# EAGLE board iSensorGetway-v0.1 (EAGLE 6.6.0), part 1 of 2
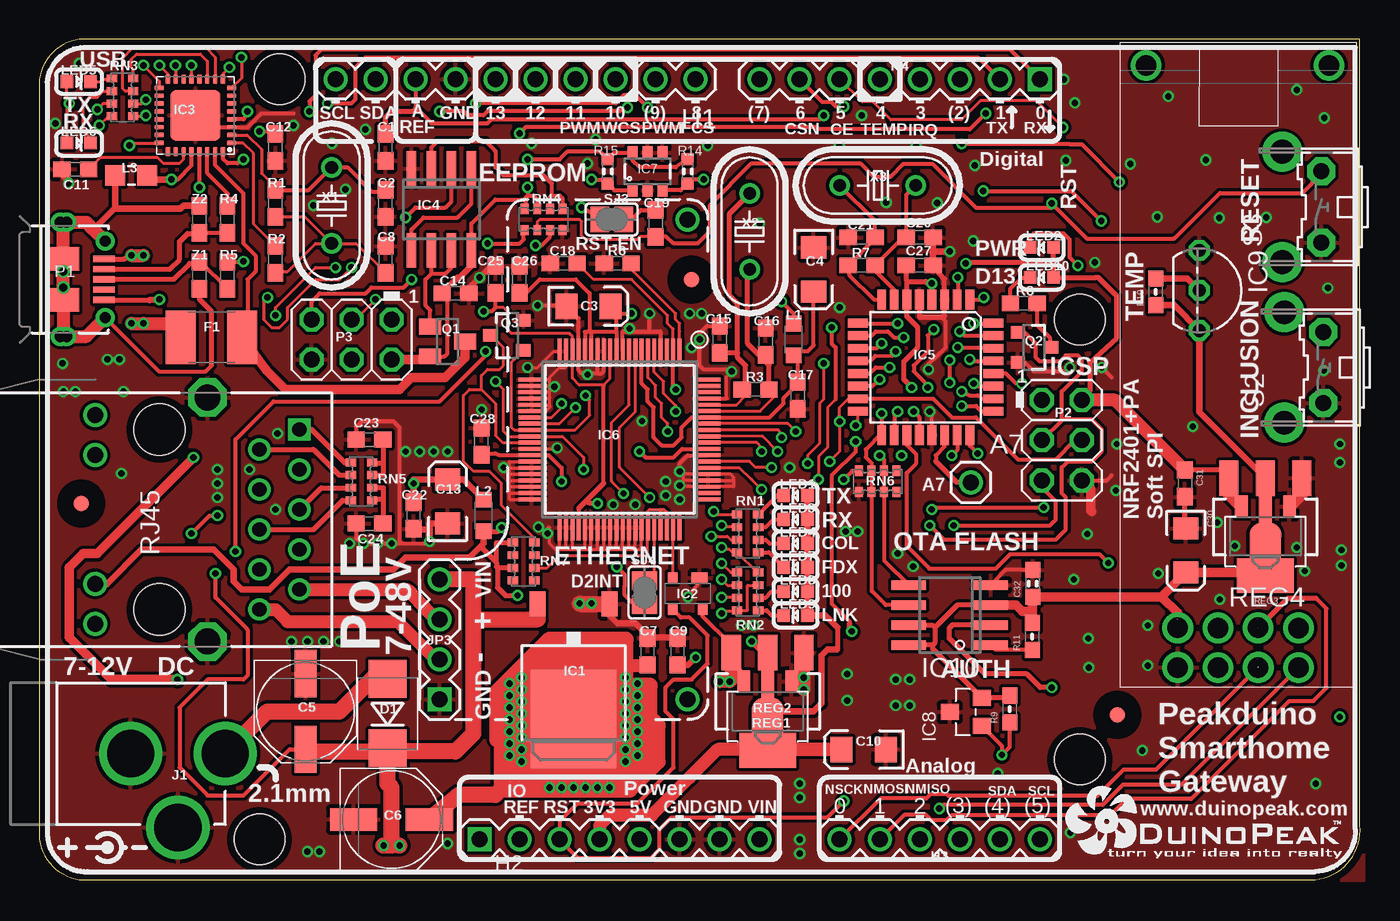
[diagram p1: board, top side]
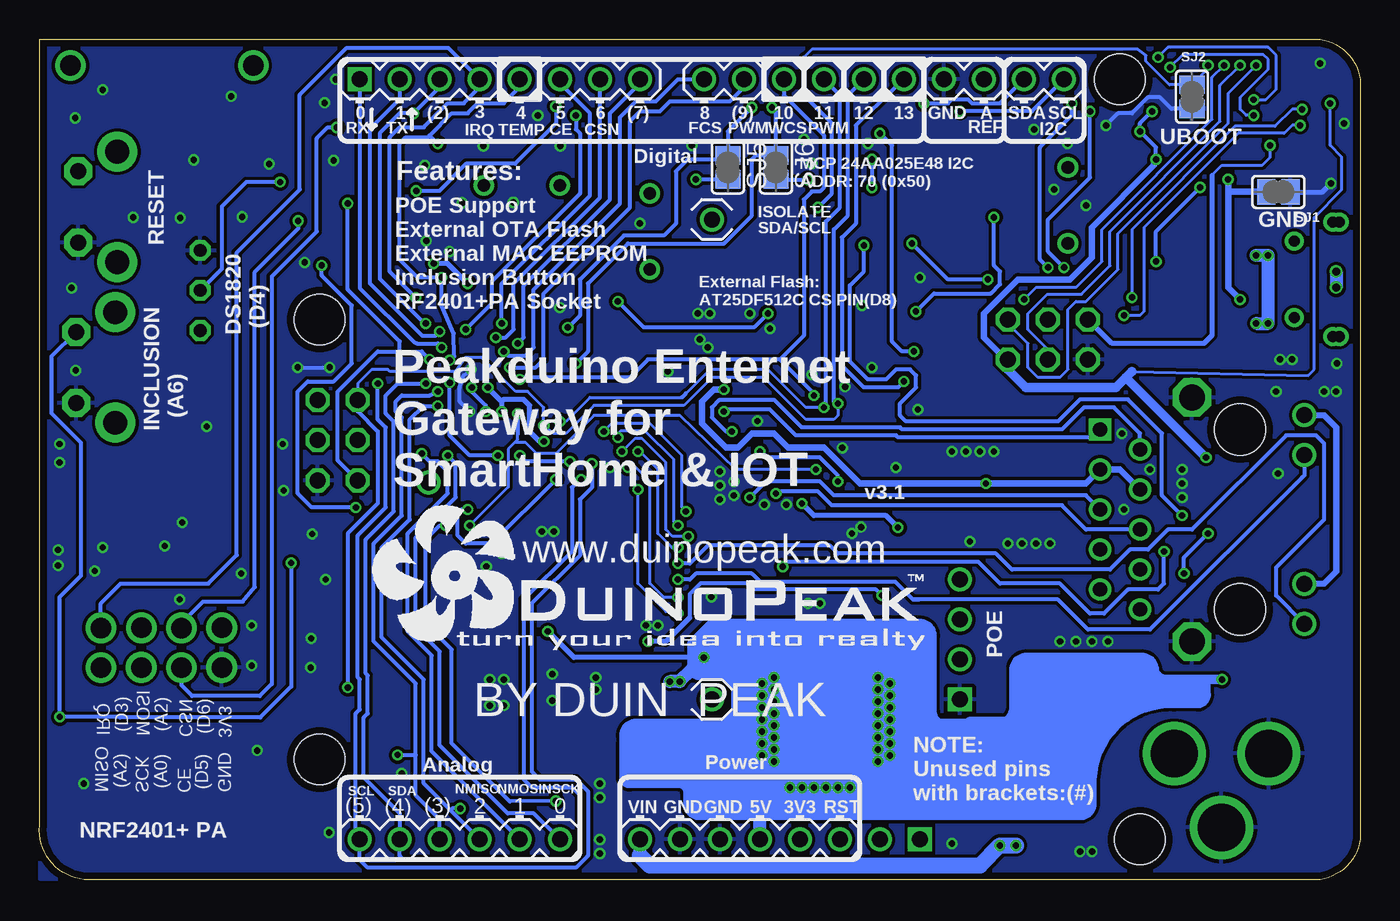
[diagram p2: board, bottom side, seen from below]

Size 83.83 x 53.34 mm. Coordinates in mm from the lower left corner, seen from the top.
Outline: 0,2.54 arc74 2.54,0 80.99,0 arc90 83.82,3.43 83.82,53.34 2.54,53.34 arc74 0,50.8 0,2.54
Copper layers (1*16): Top 0.035mm / dielectric 1.5mm / Bottom 0.035mm
Design rules "default": minimum track width 8mil, minimum drill 15mil, track to track 8mil, track to pad 8mil, pad to pad 8mil, via to via 8mil, smd to smd 8mil, copper to edge 18mil, drill to drill 8mil, minimum pad ring 10mil, minimum via ring 6mil, stop-mask expansion 4mil, vias tented up to drill 25mil, thermal gap 10mil
Net classes: 2 gnd: width 0.203 mm, drill 0.381 mm, clearance 0.178 mm
Holes 3.2 mm at 66.04,35.56 66.04,7.62 13.97,2.54 15.24,50.8
tRestrict: area 40.4,37.1 to 42.4,39.1; area 67.4,9.4 to 69.4,11.5; area 1.7,22.9 to 3.7,24.9

## Footprints (pad centres in the part's own frame; a part is rotated, then mirrored left to right if it is on the bottom)
1X01 = drill 1.016: 1 0,0
0603 = smd 1.1 x 1: 1 -0.85,0; 2 0.85,0
EIA3216 = smd 1.4 x 1.6: A 1.4,0; C -1.4,0
PANASONIC_D = smd 3 x 1.4: + 2.4,0; - -2.4,0
0603-CAP = smd 1.016 x 0.965: 1 -0.85,0; 2 0.85,0
SMB-DIODE = smd 2.4 x 2.4: A 2.2,0; C -2.2,0
L1812 = smd 1.9 x 3.4: 1 -1.95,0; 2 1.95,0
FIDUCIAL-1X2.5 = smd 1 x 1: 1 0,0
1X10 = drill 1.016: 1 0,0; 2 2.54,0; 3 5.08,0; 4 7.62,0; 5 10.16,0; 6 12.7,0; 7 15.24,0; 8 17.78,0; 9 20.32,0; 10 22.86,0
1X08 = drill 1.016 square: 1 0,0 | drill 1.016: 2 2.54,0; 3 5.08,0; 4 7.62,0; 5 10.16,0; 6 12.7,0; 7 15.24,0; 8 17.78,0
1X06 = drill 1.016: 1 0,0; 2 2.54,0; 3 5.08,0; 4 7.62,0; 5 10.16,0; 6 12.7,0
DPACK = smd 1 x 1.6: 1 -2.28,-4.8; 3 2.28,-4.8 | smd 5.4 x 6.2: 2 0,2.5
SOT143-R = smd 1 x 0.7: 1 -0.75,-1 | smd 0.6 x 0.7: 2 0.95,-1; 3 0.95,1; 4 -0.95,1
ATMEL_QFN32 = smd 0.6 x 0.3: 1 -2.3,1.75; 2 -2.3,1.25; 3 -2.3,0.75; 4 -2.3,0.25; 5 -2.3,-0.25; 6 -2.3,-0.75; 7 -2.3,-1.25; 8 -2.3,-1.75; 17 2.3,-1.75; 18 2.3,-1.25; 19 2.3,-0.75; 20 2.3,-0.25; 21 2.3,0.25; 22 2.3,0.75; 23 2.3,1.25; 24 2.3,1.75 | smd 0.3 x 0.6: 9 -1.75,-2.3; 10 -1.25,-2.3; 11 -0.75,-2.3; 12 -0.25,-2.3; 13 0.25,-2.3; 14 0.75,-2.3; 15 1.25,-2.3; 16 1.75,-2.3; 25 1.75,2.3; 26 1.25,2.3; 27 0.75,2.3; 28 0.25,2.3; 29 -0.25,2.3; 30 -0.75,2.3; 31 -1.25,2.3; 32 -1.75,2.3 | smd 3.2 x 3.2: EXP 0,0
SO08 = smd 0.6 x 2.2: 1 -1.905,-2.6; 2 -0.635,-2.6; 3 0.635,-2.6; 4 1.905,-2.6; 5 1.905,2.6; 6 0.635,2.6; 7 -0.635,2.6; 8 -1.905,2.6
TQFP32-08 = smd 1.27 x 0.559: 1 -4.293,2.8; 2 -4.293,2; 3 -4.293,1.2; 4 -4.293,0.4; 5 -4.293,-0.4; 6 -4.293,-1.2; 7 -4.293,-2; 8 -4.293,-2.8; 17 4.293,-2.8; 18 4.293,-2; 19 4.293,-1.2; 20 4.293,-0.4; 21 4.293,0.4; 22 4.293,1.2; 23 4.293,2; 24 4.293,2.8 | smd 0.559 x 1.27: 9 -2.8,-4.293; 10 -2,-4.293; 11 -1.2,-4.293; 12 -0.4,-4.293; 13 0.4,-4.293; 14 1.2,-4.293; 15 2,-4.293; 16 2.8,-4.293; 25 2.8,4.293; 26 2,4.293; 27 1.2,4.293; 28 0.4,4.293; 29 -0.4,4.293; 30 -1.2,4.293; 31 -2,4.293; 32 -2.8,4.293
SQFP80 = smd 1.6 x 0.25: 1 -5.6,3.8; 2 -5.6,3.4; 3 -5.6,3; 4 -5.6,2.6; 5 -5.6,2.2; 6 -5.6,1.8; 7 -5.6,1.4; 8 -5.6,1; 9 -5.6,0.6; 10 -5.6,0.2; 11 -5.6,-0.2; 12 -5.6,-0.6; 13 -5.6,-1; 14 -5.6,-1.4; 15 -5.6,-1.8; 16 -5.6,-2.2; 17 -5.6,-2.6; 18 -5.6,-3; 19 -5.6,-3.4; 20 -5.6,-3.8; 41 5.6,-3.8; 42 5.6,-3.4; 43 5.6,-3; 44 5.6,-2.6; 45 5.6,-2.2; 46 5.6,-1.8; 47 5.6,-1.4; 48 5.6,-1; 49 5.6,-0.6; 50 5.6,-0.2; 51 5.6,0.2; 52 5.6,0.6; 53 5.6,1; 54 5.6,1.4; 55 5.6,1.8; 56 5.6,2.2; 57 5.6,2.6; 58 5.6,3; 59 5.6,3.4; 60 5.6,3.8 | smd 0.25 x 1.6: 21 -3.8,-5.6; 22 -3.4,-5.6; 23 -3,-5.6; 24 -2.6,-5.6; 25 -2.2,-5.6; 26 -1.8,-5.6; 27 -1.4,-5.6; 28 -1,-5.6; 29 -0.6,-5.6; 30 -0.2,-5.6; 31 0.2,-5.6; 32 0.6,-5.6; 33 1,-5.6; 34 1.4,-5.6; 35 1.8,-5.6; 36 2.2,-5.6; 37 2.6,-5.6; 38 3,-5.6; 39 3.4,-5.6; 40 3.8,-5.6; 61 3.8,5.6; 62 3.4,5.6; 63 3,5.6; 64 2.6,5.6; 65 2.2,5.6; 66 1.8,5.6; 67 1.4,5.6; 68 1,5.6; 69 0.6,5.6; 70 0.2,5.6; 71 -0.2,5.6; 72 -0.6,5.6; 73 -1,5.6; 74 -1.4,5.6; 75 -1.8,5.6; 76 -2.2,5.6; 77 -2.6,5.6; 78 -3,5.6; 79 -3.4,5.6; 80 -3.8,5.6
SOT23-6 = smd 0.65 x 0.8: 1 -0.95,-1.2; 2 0,-1.2; 3 0.95,-1.2; 4 0.95,1.2; 5 0,1.2; 6 -0.95,1.2
SOT23 = smd 1.016 x 1.143: 1 -0.889,-1.016; 2 0.889,-1.016; 3 0,1.016
TO92- = drill 0.813 octagon: 1 -2.54,0; 2 0,0; 3 2.54,0
SO-08 = smd 0.6 x 2.2: 1 -1.905,-2.6; 2 -0.635,-2.6; 3 0.635,-2.6; 4 1.905,-2.6; 5 1.905,2.6; 6 0.635,2.6; 7 -0.635,2.6; 8 -1.905,2.6
POWER_JACK_PTH = drill 2.997: GND 0,7.7; GNDBREAK 4.7,10.7; PWR 0,13.7
FT-POE-MODULE-NOLABEL = drill 1.016 square: 1 0,0 | drill 1.016: 2 2.54,0; 3 5.08,0; 4 7.62,0; MNT1 0,-15.748; MNT2 30.48,-15.748
L2012C = smd 1 x 1: 1 -1,0; 2 1,0
0805-LARGE = smd 1.27 x 1.27: 1 -1.016,0; 2 1.016,0
LED-0603 = smd 0.8 x 0.8: A 0,-0.75; C 0,0.75
USB-MICROB-MB05PMXX = smd 0.4 x 1.35: D+ 0,2.575; D- -0.65,2.575; GND 1.3,2.575; ID 0.65,2.575; VBUS -1.3,2.575 | smd 1.5 x 2: FIX1 -1.3,0; FIX2 1.3,0 | drill 0.7: PIN1 -2.425,2.65; PIN2 2.425,2.65; SLOT1 -3.625,-0.2; SLOT2 3.625,-0.2; TAB1 -3.625,0.2; TAB2 3.625,0.2
2X03 = drill 1.016 octagon: 1 -2.54,-1.27; 2 -2.54,1.27; 3 0,-1.27; 4 0,1.27; 5 2.54,-1.27; 6 2.54,1.27
SOT23' = smd 1 x 1.4: 1 -0.95,-1.1; 2 0.95,-1.1; 3 0,1.1
SOT23-3 = smd 0.8 x 0.9: 1 -0.95,-1; 2 0.95,-1; 3 0,1.1
0603-RES = smd 1.016 x 0.965: 1 -0.85,0; 2 0.85,0
0603' = smd 0.762 x 0.762: 1 -0.762,0; 2 0.762,0
SOT89 = smd 0.8 x 1.4: 1 -1.524,-1.905; 3 1.524,-1.905 | smd 0.8 x 1.9: 2 0,-1.651 | smd 2.032 x 3.65: 4 0,0.94
SOT223 = smd 1.219 x 2.235: 1 -2.311,-3.099; 2 0,-3.099; 3 2.311,-3.099 | smd 3.6 x 2.2: 4 0,3.099
CAY16 = smd 0.5 x 0.65: 1 -1.2,-0.675; 2 -0.4,-0.675; 3 0.4,-0.675; 4 1.2,-0.675; 5 1.2,0.675; 6 0.4,0.675; 7 -0.4,0.675; 8 -1.2,0.675
B3F-31XX = drill 1.016 pad 1.778 octagon: 1 -2.261,-1.245; 2 2.261,-1.245 | drill 1.499 pad 2.54: 3 -3.505,1.245; 4 3.505,1.245
SJ = smd 1.168 x 1.6: 1 -0.762,0; 2 0.762,0
SJC = smd 1.168 x 1.6: 1 -0.762,0; 2 0.762,0
HY931147C = drill 1.63 octagon: GND1 3.05,7.745; GND2 3.05,-7.745 | drill 0.9 square: P$1 8.89,5.715 | drill 0.9: P$2 6.35,4.445; P$3 8.89,3.175; P$4 6.35,1.905; P$5 8.89,0.635; P$6 6.35,-0.635; P$7 8.89,-1.905; P$8 6.35,-3.175; P$9 8.89,-4.445; P$10 6.35,-5.715 | drill 1.016: P$11 -4.08,6.625; P$12 -4.08,4.085; P$13 -4.08,-4.085; P$14 -4.08,-6.625 | hole 3.25: 0,5.715; 0,-5.715
NRF2401_PA_OUTLINE = drill 1.3: 3V3 3.677,3.785; CE 6.236,1.264; CSN 6.229,3.778; GND 3.683,1.27; GND1 1.676,39.491; GND2 13.278,39.484; IRQ 11.347,3.778; MISO 11.354,1.264; MOSI 8.782,3.785; SCK 8.788,1.27
HC49U-V = drill 0.813: 1 -2.413,0; 2 2.413,0

## Placement (x,y rotation side)
A7  M01PTH  [1X01]  59.12,25.21 0 top
C1  100nF 0603  [0603]  21.97,46.48 270 top
C2  22pF 0603  [0603]  21.97,42.93 90 top
C3  10uF 6.3V A TANT  [EIA3216]  34.85,36.4 0 top
C4  10uF 6.3V A TANT  [EIA3216]  49.15,38.73 270 top
C5  47uF 25V  [PANASONIC_D]  16.89,10.67 270 top
C6  47uF 25V  [PANASONIC_D]  22.35,3.81 0 top
C7  100nF 0603  [0603]  38.61,14.48 90 top
C8  22pF 0603  [0603]  21.97,39.37 270 top
C9  1uF 0603  [0603]  40.51,14.48 90 top
C10  10uF 6.3V A TANT  [EIA3216]  52.32,8.26 180 top
C11  1uF 0603  [0603]  2.29,45.09 180 top
C12  100nF 0603  [0603]  14.99,46.48 270 top
C13  10uF 6.3V A TANT  [EIA3216]  25.91,24 90 top
C14  100nF 0603  [0603]  26.42,37.21 0 top
C15  13pF  [0603]  43.18,34.29 90 top
C16  13pF  [0603]  46.1,34.16 90 top
C17  100nF  [0603]  48.13,30.73 270 top
C18  10nF  [0603]  33.27,39.12 180 top
C19  100nF 0603  [0603]  39.12,41.66 270 top
C20  22pF 0603  [0603]  55.88,40.77 180 top
C21  22pF 0603  [0603]  52.2,40.77 0 top
C22  100nF  [0603]  23.75,23.11 270 top
C23  100nF  [0603]  20.95,27.94 180 top
C24  100nF  [0603]  20.95,22.61 180 top
C25  100nF  [0603]  28.96,38.1 90 top
C26  100nF  [0603]  30.48,38.1 90 top
C27  100nF 0603  [0603]  55.88,38.99 0 top
C28  100nF  [0603]  28.07,27.81 90 top
C30  10uF 6.3V A TANT  [EIA3216]  72.77,20.89 270 top
C31  1uF 0603  [0603]  72.71,25.15 270 top
C32  0.1u  [0603-CAP]  63.06,18.8 90 top
D1  1N4004 SMB  [SMB-DIODE]  22.1,10.54 90 top
F1  500mA PTC 1812  [L1812]  10.92,34.42 0 top
FID1  FIDUCIAL1X2.5  [FIDUCIAL-1X2.5]  41.4,38.1 0 top
FID2  FIDUCIAL1X2.5  [FIDUCIAL-1X2.5]  68.42,10.45 0 top
FID3  FIDUCIAL1X2.5  [FIDUCIAL-1X2.5]  2.67,23.88 0 top
H1  Digital_8_13  [1X10]  41.66,50.8 180 top
H2  Power  [1X08]  27.94,2.54 0 top
H3  Analog  [1X06]  50.8,2.54 0 top
H4  Digital_0_7  [1X08]  63.5,50.8 180 top
IC1  MC33269DT-5.0  [DPACK]  33.91,12.7 180 top
IC2  APX811-44UG-7  [SOT143-R]  41.15,18.16 180 top
IC3  ATMEGA16U2-MU  [ATMEL_QFN32]  9.91,48.51 180 top
IC4  LM358D  [SO08]  25.53,42.55 180 top
IC5  ATMEGA328P TQFP32  [TQFP32-08]  56.26,32.53 270 top
IC6  W5100SQFP80  [SQFP80]  36.83,27.94 270 top
IC7  24AA025E48  [SOT23-6]  38.61,44.96 0 top
IC8  ATSHA204A  [SOT23]  58.8,10.64 90 top
IC9  DS1820  [TO92-]  73.63,37.4 270 top
IC10  AT25DF512C-SSHN-B  [SO-08]  57.78,16.8 90 top
J1  DC_2_1MM  [POWER_JACK_PTH]  -1.91,8 270 top
JP3  FT-POE-MODULE3  [FT-POE-MODULE-NOLABEL]  25.4,11.43 90 top
L1  1uH 250mA 0805  [L2012C]  47.88,34.29 270 top
L2  1uH 250mA 0805  [L2012C]  28.19,23.11 90 top
L3  0805 INDUCTOR  [0805-LARGE]  5.84,44.7 0 top
LED1  YELLOW  [LED-0603]  48.01,24.38 90 top
LED2  PWR/BLUE  [LED-0603]  63.63,40.13 90 top
LED3  YELLOW  [LED-0603]  48.01,22.86 90 top
LED4  RED  [LED-0603]  48.01,21.34 90 top
LED5  TX/YEL  [LED-0603]  2.5,50.65 270 top
LED6  RX/GRN  [LED-0603]  2.5,46.76 270 top
LED7  GREEN  [LED-0603]  48.01,19.81 90 top
LED8  GREEN  [LED-0603]  48.01,18.29 90 top
LED9  YELLOW  [LED-0603]  48.01,16.76 90 top
LED10  D13/RED  [LED-0603]  63.63,38.23 90 top
P1  USB-6PSMT  [USB-MICROB-MB05PMXX]  1.52,38.1 270 top
P2  ICSP:MAIN  [2X03]  64.91,27.89 270 top
P3  ICSP:USB  [2X03]  19.81,34.29 180 top
Q1  FDN340P  [SOT23']  25.91,34.16 270 top
Q2  2N7002  [SOT23-3]  63.12,33.78 270 top
Q3  2N7002  [SOT23-3]  29.72,34.54 90 top
R1  1M 0603  [0603]  14.99,42.93 90 top
R2  27R 0603  [0603]  14.99,39.37 270 top
R3  1M  [0603]  45.47,31.11 0 top
R4  22R 0603  [0603]  11.94,41.91 270 top
R5  22R 0603  [0603]  11.94,38.35 270 top
R6  12K3 1%  [0603]  36.7,39.12 0 top
R7  1M 0603  [0603]  52.2,38.99 0 top
R8  1K 0603  [0603]  62.48,36.58 180 top
R9  56k  [0603-RES]  61.59,10.83 90 top
R10  10k  [0603-RES]  70.87,37.31 90 top
R11  [0603-RES]  63.02,15.43 90 top
R14  4K7  [0603']  41.15,44.96 270 top
R15  4K7  [0603']  36.07,44.96 270 top
REG1  LD1117-SOT89  [SOT89]  46.23,10.67 180 top
REG2  LD1117-SOT223  [SOT223]  46.23,11.3 180 top
REG3  LD1117-SOT223  [SOT223]  77.82,22.38 180 top
REG4  LD1117-SOT89  [SOT89]  77.82,21.78 180 top
RN1  1K  [CAY16]  44.96,21.97 270 top
RN2  1K  [CAY16]  44.96,18.29 270 top
RN3  1K  [CAY16]  5.28,49.66 270 top
RN4  10K  [CAY16]  32,41.91 0 top
RN5  49R9 1%  [CAY16]  20.45,25.27 270 top
RN6  1K  [CAY16]  53.21,25.27 0 top
RN7  1K  [CAY16]  30.73,20.19 90 top
S2  [B3F-31XX]  80.26,32.51 90 top
S3  [B3F-31XX]  80.14,42.7 90 top
SJ1  GROUND  [SJ]  5.19,43.66 0 bottom
SJ2  UBOOT  [SJ]  10.67,49.7 90 bottom
SJ3  RESET-EN  [SJ]  36.32,41.91 0 top
SJ4  D2_INT  [SJ]  38.42,18.22 90 top
SJ5  [SJC]  40.13,45.21 270 bottom
SJ6  [SJC]  37.08,45.21 270 bottom
U1  HY931147C-RJ45  [HY931147C]  7.62,22.86 0 top
U$8  [DUINOPEAK-LOGO-1.2]  62.8,14.57 0 bottom
U$17  NRF2401  [NRF2401_PA_OUTLINE]  68.58,12.19 0 top
U$20  [DUINOPEAK-LOGO-0.6]  65.09,1.33 0 top
X1  16MHz  [HC49U-V]  18.54,42.8 90 top
X2  25MHz  [HC49U-V]  45.09,41.15 270 top
X3  16MHz  [HC49U-V]  53.21,44.07 0 top
Z1  PGB1010603  [0603]  10.16,38.35 270 top
Z2  PGB1010603  [0603]  10.16,41.91 90 top